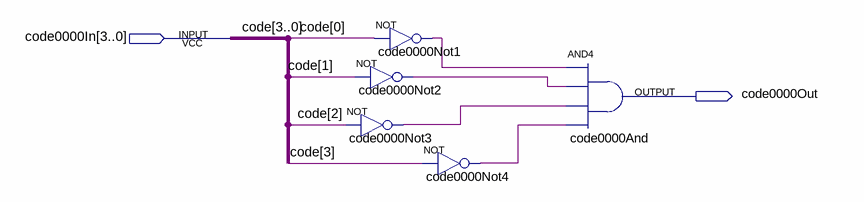
[diagram p0: schematic sheet]
// Quartus schematic code0000.bdf as structural Verilog: 5 symbols, 2 pins
module code0000 (
  input  [3:0] code0000In,
  output code0000Out
);

  wire code0000Not1_out, code0000Not2_out, code0000Not3_out, code0000Not4_out;

  not code0000Not1 (code0000Not1_out, code0000In[0]);
  not code0000Not2 (code0000Not2_out, code0000In[1]);
  not code0000Not3 (code0000Not3_out, code0000In[2]);
  not code0000Not4 (code0000Not4_out, code0000In[3]);
  and code0000And (code0000Out, code0000Not1_out, code0000Not2_out, code0000Not3_out, code0000Not4_out);

  // Other names for the same wires on the sheet: code[3:0] = code0000In
endmodule
